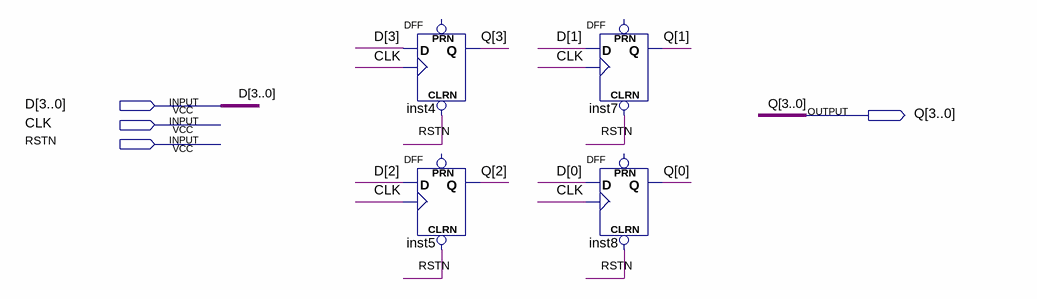
[diagram p0: schematic sheet]
// Quartus schematic reg4.bdf as structural Verilog: 4 symbols, 4 pins
module reg4 (
  input  [3:0] D,
  input  CLK,
  input  RSTN,
  output [3:0] Q
);

  DFF inst4 (.CLRN(RSTN), .CLK(CLK), .D(D[3]), .Q(Q[3]));  // open: PRN
  DFF inst5 (.CLRN(RSTN), .CLK(CLK), .D(D[2]), .Q(Q[2]));  // open: PRN
  DFF inst7 (.CLRN(RSTN), .CLK(CLK), .D(D[1]), .Q(Q[1]));  // open: PRN
  DFF inst8 (.CLRN(RSTN), .CLK(CLK), .D(D[0]), .Q(Q[0]));  // open: PRN
endmodule
